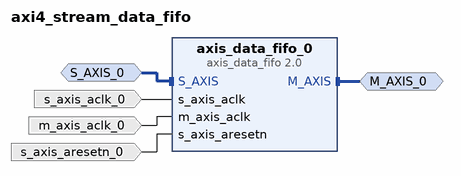
[diagram p0: block diagram of the top level]
# Vivado block design axi4_stream_data_fifo, xc7z020clg400-2, Vivado 2019.1
create_bd_design axi4_stream_data_fifo

create_bd_intf_port -mode Slave -vlnv xilinx.com:interface:axis_rtl:1.0 S_AXIS_0
set_property -dict [list \
  CONFIG.HAS_TKEEP 1 \
  CONFIG.HAS_TLAST 1 \
  CONFIG.HAS_TREADY 1 \
  CONFIG.HAS_TSTRB 0 \
  CONFIG.LAYERED_METADATA undef \
  CONFIG.TDATA_NUM_BYTES 4 \
  CONFIG.TDEST_WIDTH 0 \
  CONFIG.TID_WIDTH 0 \
  CONFIG.TUSER_WIDTH 0 \
] [get_bd_intf_ports S_AXIS_0]
create_bd_intf_port -mode Master -vlnv xilinx.com:interface:axis_rtl:1.0 M_AXIS_0
create_bd_port -dir I -type clk s_axis_aclk_0
create_bd_port -dir I -type clk m_axis_aclk_0
create_bd_port -dir I -type rst s_axis_aresetn_0

create_bd_cell -type ip -vlnv xilinx.com:ip:axis_data_fifo:2.0 axis_data_fifo_0
set_property -dict [list \
  CONFIG.FIFO_MEMORY_TYPE block \
  CONFIG.HAS_TKEEP 1 \
  CONFIG.HAS_TLAST 1 \
  CONFIG.HAS_TSTRB 0 \
  CONFIG.IS_ACLK_ASYNC 1 \
  CONFIG.TDATA_NUM_BYTES 4 \
  CONFIG.TDEST_WIDTH 0 \
  CONFIG.TID_WIDTH 0 \
  CONFIG.TUSER_WIDTH 0 \
] [get_bd_cells axis_data_fifo_0]

# ---- connections ----

connect_bd_intf_net [get_bd_intf_ports M_AXIS_0] [get_bd_intf_pins axis_data_fifo_0/M_AXIS]
connect_bd_intf_net -intf_net S_AXIS_0_1 [get_bd_intf_ports S_AXIS_0] [get_bd_intf_pins axis_data_fifo_0/S_AXIS]
connect_bd_net -net s_axis_aclk_0_1 [get_bd_ports s_axis_aclk_0] [get_bd_pins axis_data_fifo_0/s_axis_aclk]
connect_bd_net -net m_axis_aclk_0_1 [get_bd_ports m_axis_aclk_0] [get_bd_pins axis_data_fifo_0/m_axis_aclk]
connect_bd_net -net s_axis_aresetn_0_1 [get_bd_ports s_axis_aresetn_0] [get_bd_pins axis_data_fifo_0/s_axis_aresetn]

validate_bd_design
save_bd_design
